# EAGLE design timer (EAGLE 9.3.0)
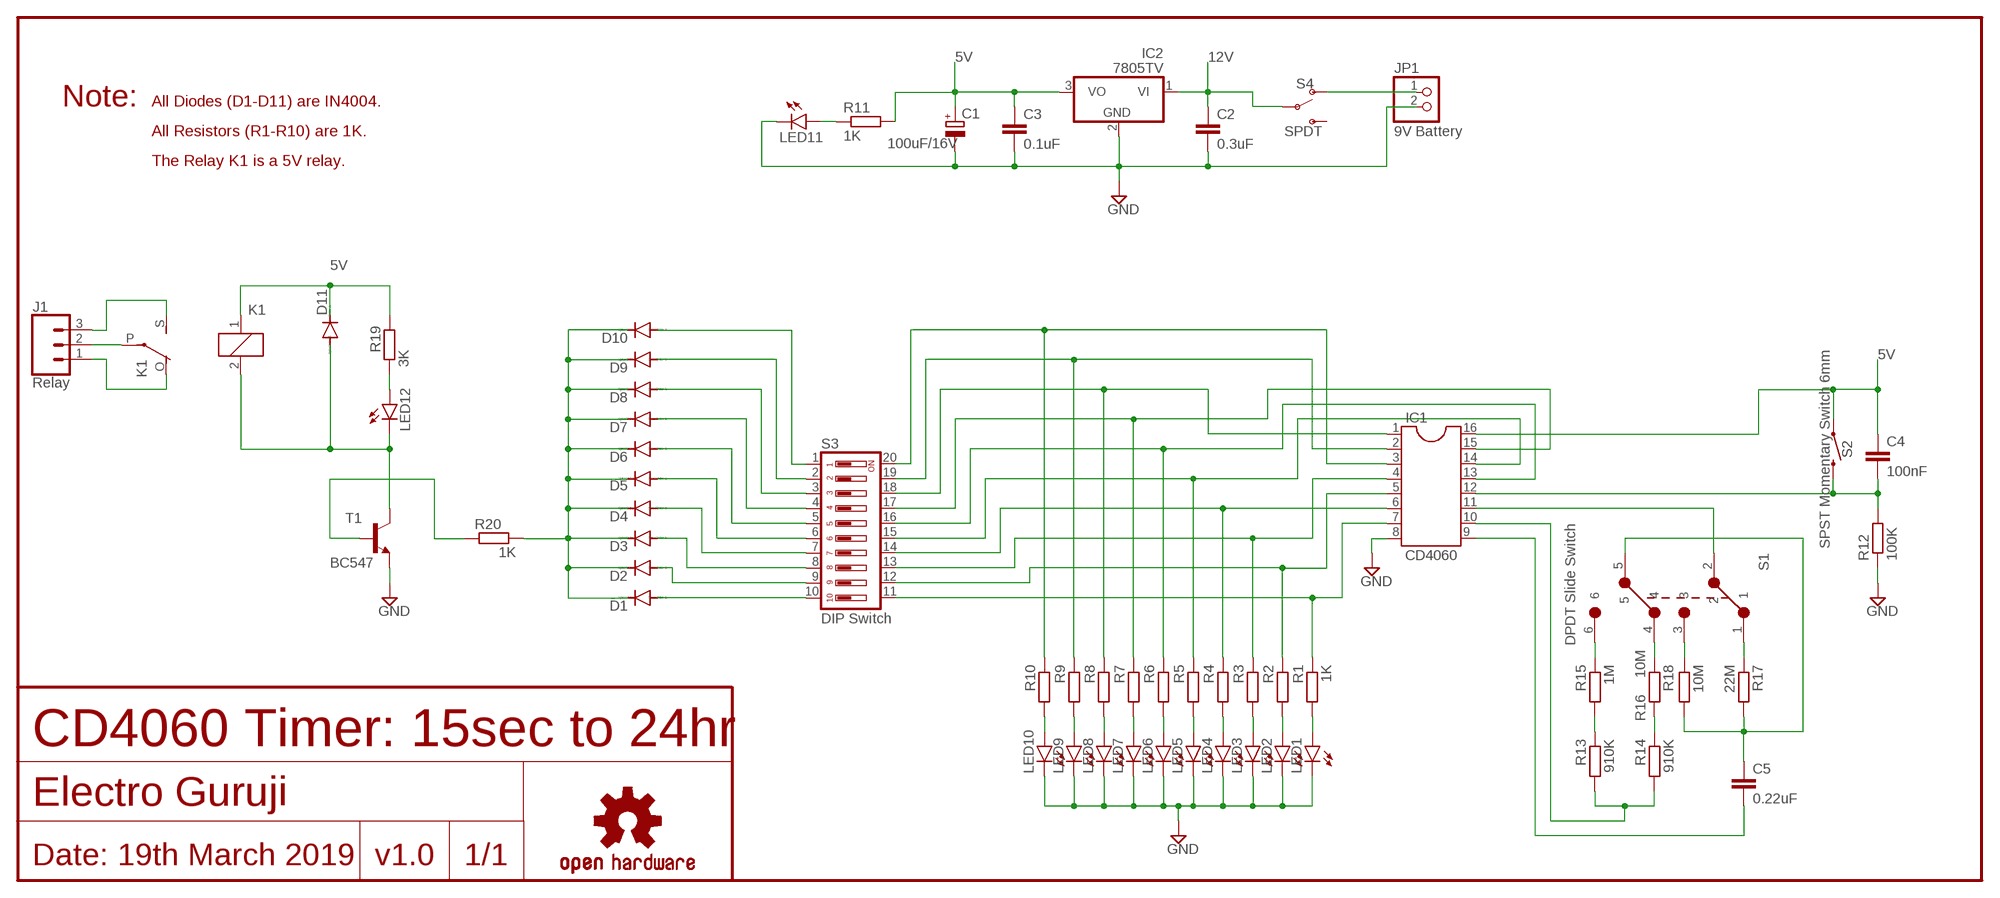
[diagram p0: schematic, sheet 1]

## Parts
C1  100uF/16V  CPOL-EUE2.5-6  [E2,5-6]
C2  0.3uF  C-EU025-050X050  [C025-050X050]
C3  0.1uF  C-EU025-050X050  [C025-050X050]
C4  100nF  C-EU025-050X050  [C025-050X050]
C5  0.22uF  C-EU102-043X133  [C102-043X133]
D1  1N4004  [DO41-10]
D2  1N4004  [DO41-10]
D3  1N4004  [DO41-10]
D4  1N4004  [DO41-10]
D5  1N4004  [DO41-10]
D6  1N4004  [DO41-10]
D7  1N4004  [DO41-10]
D8  1N4004  [DO41-10]
D9  1N4004  [DO41-10]
D10  1N4004  [DO41-10]
D11  1N4004  [DO41-10]
IC1  CD4060  DIL16S  [SOCKET-16]
IC2  7805TV  [TO220V]
J1  Relay  CONN_03-SCREW-5MM  [SCREWTERMINAL-5MM-3]
JP1  9V Battery  PINHD-1X2  [1X02]
K1  5V  ZF112  [ZF112]
LED1  LED5MM  [LED5MM]
LED2  LED5MM  [LED5MM]
LED3  LED5MM  [LED5MM]
LED4  LED5MM  [LED5MM]
LED5  LED5MM  [LED5MM]
LED6  LED5MM  [LED5MM]
LED7  LED5MM  [LED5MM]
LED8  LED5MM  [LED5MM]
LED9  LED5MM  [LED5MM]
LED10  LED5MM  [LED5MM]
LED11  LED5MM  [LED5MM]
LED12  LED5MM  [LED5MM]
LOGO1  OSHW-LOGOS-COPPER  [OSHW-LOGO-S_COPPER]
R1  1K  R-EU_0207/10  [0207/10]
R2  R-EU_0207/10  [0207/10]
R3  R-EU_0207/10  [0207/10]
R4  R-EU_0207/10  [0207/10]
R5  R-EU_0207/10  [0207/10]
R6  R-EU_0207/10  [0207/10]
R7  R-EU_0207/10  [0207/10]
R8  R-EU_0207/10  [0207/10]
R9  R-EU_0207/10  [0207/10]
R10  R-EU_0207/10  [0207/10]
R11  1K  R-EU_0207/10  [0207/10]
R12  100K  R-EU_0207/10  [0207/10]
R13  910K  R-EU_0207/10  [0207/10]
R14  910K  R-EU_0207/10  [0207/10]
R15  1M  R-EU_0207/10  [0207/10]
R16  10M  R-EU_0207/10  [0207/10]
R17  22M  R-EU_0207/10  [0207/10]
R18  10M  R-EU_0207/10  [0207/10]
R19  3K  R-EU_0207/10  [0207/10]
R20  1K  R-EU_0207/10  [0207/10]
S1  DPDT Slide Switch  DPDT_SEC  [DPDT_SEC]
S2  SPST Momentary Switch 6mm  MOMENTARY-SWITCH-SPST-PTH-6.0MM  [TACTILE_SWITCH_PTH_6.0MM]
S3  DIP Switch  DIP10YL  [DIP10YL]
S4  SPDT  SWITCH-SPDT-PTH-11.6X4.0MM  [SWITCH_SPDT_PTH_11.6X4.0MM]
T1  BC547  -NPN-TO92-EBC  [TO92-EBC]

## Nets
5V: C1.+ C3.1 C4.1 D11.C IC1.16 IC2.3(VO) K1.1 R11.2 R19.2 S2.1
12V: C2.1 IC2.1(VI) S4.2(P)
GND: C1.- C2.2 C3.2 IC1.8 IC2.2(GND) JP1.2 LED1.K(C) LED2.K(C) LED3.K(C) LED4.K(C) LED5.K(C) LED6.K(C) LED7.K(C) LED8.K(C) LED9.K(C) LED10.K(C) LED11.K(C) R12.1 T1.E
N$1: C4.2 IC1.12 R12.2 S2.3
N$2: LED11.A R11.1
N$3: IC1.10 R13.2 R14.2
N$4: IC1.7 R1.1 S3.11
N$5: R13.1 R15.2
N$6: R14.1 R16.2
N$7: C5.1 R17.2 R18.2 S1.5
N$8: R18.1 S1.3
N$9: R17.1 S1.1
N$10: R16.1 S1.4
N$11: R15.1 S1.6
N$12: IC1.11 S1.2
N$13: C5.2 IC1.9
N$14: D1.A S3.10
N$15: IC1.5 R2.1 S3.12
N$16: IC1.4 R3.1 S3.13
N$17: IC1.6 R4.1 S3.14
N$18: IC1.14 R5.1 S3.15
N$19: IC1.13 R6.1 S3.16
N$20: IC1.15 R7.1 S3.17
N$21: IC1.1 R8.1 S3.18
N$22: IC1.2 R9.1 S3.19
N$23: IC1.3 R10.1 S3.20
N$24: D2.A S3.9
N$25: D3.A S3.8
N$26: D4.A S3.7
N$27: D5.A S3.6
N$28: D6.A S3.5
N$29: D7.A S3.4
N$30: D8.A S3.3
N$31: D9.A S3.2
N$32: D10.A S3.1
N$33: LED10.A R10.2
N$34: LED9.A R9.2
N$35: LED8.A R8.2
N$36: LED7.A R7.2
N$37: LED6.A R6.2
N$38: LED5.A R5.2
N$39: LED4.A R4.2
N$40: LED3.A R3.2
N$41: LED2.A R2.2
N$42: LED1.A R1.2
N$44: R20.2 T1.B
N$45: D11.A K1.2 LED12.K(C) T1.C
N$46: LED12.A R19.1
N$48: J1.2 K1.P(2:P)
N$49: J1.3 K1.S(2:S)
N$50: J1.1 K1.O(2:O)
N$51: JP1.1 S4.1(O)
N$52: D1.C D2.C D3.C D4.C D5.C D6.C D7.C D8.C D9.C D10.C R20.1
Unconnected: S4.3(S)

## Notes on the sheet
- Note: | All Diodes (D1-D11) are IN4004.
- All Resistors (R1-R10) are 1K.
- The Relay K1 is a 5V relay.
- CD4060 Timer: 15sec to 24hr
- Electro Guruji
- Date: 19th March 2019 | v1.0 | 1/1

## Library data of the parts
C1 = resistor:CPOL-EU: POLARIZED CAPACITOR, European symbol
C2-C5 = resistor:C-EU: CAPACITOR, European symbol
D1-D11 = diode:1N4004: DIODE general purpose rectifier, 1 A
IC1 = ic-package:DIL16: Dual In Line / Socket
IC2 = linear:78*: Positive VOLTAGE REGULATOR Source: http://cache.national.com/ds/LM/LM78L05.pdf http://www.fairchildsemi.com/ds/LM/LM7805.pdf
J1 = SparkFun-Connectors:CONN_03: Multi connection point. Often used as Generic Header-pin footprint for 0.1 inch spaced/style header connections On any of the 0.1 inch spaced packages, you can populate with these: Break Away Headers - Straight <https://www.sparkfun.com/products/116> (PRT-00116) Break Away Male Headers - Right Angle <https://www.sparkfun.com/products/553> (PRT-00553) Female Headers <https://www.sparkfun.com/products/115> (PRT-00115) Break Away Headers - Machine Pin <https://www.sparkfun.com/products/117> (PRT-00117) Break Away Female Headers - Swiss Machine Pin <https://www.sparkfun.com/products/743> (PRT-00743) Stackable Header - 3 Pin (Female, 0.1") <https://www.sparkfun.com/products/13875> (PRT-13875) For SCREWTERMINALS and SPRING TERMINALS visit here: Screw Terimnals on SparkFun.com <https://www.sparkfun.com/search/results?term=Screw+Terminals> (5mm/3.5mm/2.54mm spacing) This device is also useful as a general connection point to wire up your design to another part of your project. Our various solder wires solder well into these plated through hole pads. Hook-Up Wire - Assortment (Stranded, 22 AWG) <https://www.sparkfun.com/products/11375> (PRT-11375) Hook-Up Wire - Assortment (Solid Core, 22 AWG) <https://www.sparkfun.com/products/11367> (PRT-11367) View the entire wire category on our website here <https://www.sparkfun.com/categories/141> Special notes: Molex polarized connector foot print use with SKU : PRT-08232 with associated crimp pins and housings.; PROD_ID: CONN-10134; SF_SKU: PRT-08433
JP1 = pinhead:PINHD-1X2: PIN HEADER
K1 = relay:ZF112: RELAY 1 x switch; OC_FARNELL: unknown; OC_NEWARK: unknown
LED1-LED12 = led:LED: LED OSRAM: - CHIPLED LG R971, LG N971, LY N971, LG Q971, LY Q971, LO R971, LY R971 LH N974, LH R974 LS Q976, LO Q976, LY Q976 LO Q996 - Hyper CHIPLED LW Q18S LB Q993, LB Q99A, LB R99A - SideLED LS A670, LO A670, LY A670, LG A670, LP A670 LB A673, LV A673, LT A673, LW A673 LH A674 LY A675 LS A676, LA A676, LO A676, LY A676, LW A676 LS A679, LY A679, LG A679 - Hyper Micro SIDELED® LS Y876, LA Y876, LO Y876, LY Y876 LT Y87S - SmartLED LW L88C, LW L88S LB L89C, LB L89S, LG L890 LS L89K, LO L89K, LY L89K LS L896, LA L896, LO L896, LY L896 - TOPLED LS T670, LO T670, LY T670, LG T670, LP T670 LSG T670, LSP T670, LSY T670, LOP T670, LYG T670 LG T671, LOG T671, LSG T671 LB T673, LV T673, LT T673, LW T673 LH T674 LS T676, LA T676, LO T676, LY T676, LB T676, LH T676, LSB T676, LW T676 LB T67C, LV T67C, LT T67C, LS T67K, LO T67K, LY T67K, LW E67C LS E67B, LA E67B, LO E67B, LY E67B, LB E67C, LV E67C, LT E67C LW T67C LS T679, LY T679, LG T679 LS T770, LO T770, LY T770, LG T770, LP T770 LB T773, LV T773, LT T773, LW T773 LH T774 LS E675, LA E675, LY E675, LS T675 LS T776, LA T776, LO T776, LY T776, LB T776 LHGB T686 LT T68C, LB T68C - Hyper Mini TOPLED® LB M676 - Mini TOPLED Santana® LG M470 LS M47K, LO M47K, LY M47K Source: http://www.osram.convergy.de LUXEON: - LUMILED® LXK2-PW12-R00, LXK2-PW12-S00, LXK2-PW14-U00, LXK2-PW14-V00 LXK2-PM12-R00, LXK2-PM12-S00, LXK2-PM14-U00 LXK2-PE12-Q00, LXK2-PE12-R00, LXK2-PE12-S00, LXK2-PE14-T00, LXK2-PE14-U00 LXK2-PB12-K00, LXK2-PB12-L00, LXK2-PB12-M00, LXK2-PB14-N00, LXK2-PB14-P00, LXK2-PB14-Q00 LXK2-PR12-L00, LXK2-PR12-M00, LXK2-PR14-Q00, LXK2-PR14-R00 LXK2-PD12-Q00, LXK2-PD12-R00, LXK2-PD12-S00 LXK2-PH12-R00, LXK2-PH12-S00 LXK2-PL12-P00, LXK2-PL12-Q00, LXK2-PL12-R00 Source: www.luxeon.com KINGBRIGHT: KA-3528ASYC Source: www.kingbright.com
LOGO1 = SparkFun-Aesthetics:OSHW-LOGO: Open-Source Hardware (OSHW) Logo This logo indicates the piece of hardware it is found on incorporates a OSHW license and/or adheres to the definition of open source hardware found here: http://freedomdefined.org/OSHW
R1-R20 = resistor:R-EU_: RESISTOR, European symbol
S1 = mylibrary:DPDT_SEC: SEC - DPDT Slide Switch A DPDT Slide Switch with 2 mounting holes and "SEC" inscripted on it
S2 = SparkFun-Switches:MOMENTARY-SWITCH-SPST: Momentary Switch (Pushbutton) - SPST Normally-open (NO) SPST momentary switches (buttons, pushbuttons). Variants PTH-12MM - 12mm square, through-hole Momentary Pushbutton Switch - 12mm Square <https://www.sparkfun.com/products/9190> (COM-09190) PTH-6.0MM, PTH-6.0MM-KIT - 6.0mm square, through-hole Mini Pushbutton Switch <https://www.sparkfun.com/products/97> (COM-00097) KIT package intended for soldering kit's - only one side of pads' copper is exposed. PTH-RIGHT-ANGLE-KIT - Right-angle, through-hole Right Angle Tactile Button <https://www.sparkfun.com/products/10791> - Used on SparkFun BigTime Watch Kit <https://www.sparkfun.com/products/11734> SMD-12MM - 12mm square, surface-mount Tactile Button - SMD (12mm) <https://www.sparkfun.com/products/12993> (COM-12993) Used on SparkFun PicoBoard <https://www.sparkfun.com/products/11888> SMD-4.5MM - 4.5mm Square Trackball Switch Used on SparkFun Blackberry Trackballer Breakout <https://www.sparkfun.com/products/13169> SMD-4.6MMX2.8MM - 4.60mm x 2.80mm, surface mount Used on SparkFun SAMD21 Mini Breakout <https://www.sparkfun.com/products/13664> SMD-5.2MM, SMD-5.2-REDUNDANT - 5.2mm square, surface-mount Mini Pushbutton Switch - SMD <https://www.sparkfun.com/products/8720> (COM-08720) Used on Arduino Pro Mini <https://www.sparkfun.com/products/11114> REDUNDANT package connects both switch circuits together SMD-6.0X3.5MM - 6.0 x 3.5mm, surface mount Momentary Reset Switch SMD <https://www.sparkfun.com/products/8229> (COM-08229) SMD-6.2MM-TALL - 6.2mm square, surface mount Tactile Button - SMD (6mm) <https://www.sparkfun.com/products/12992> Used on SparkFun Digital Sandbox <https://www.sparkfun.com/products/12651> SMD-RIGHT-ANGLE - Right-angle, surface mount Used on SparkFun Block for Intel® Edison - Arduino <https://www.sparkfun.com/products/13036>; PROD_ID: SWCH-08441; SF_SKU: COM-00097
S3 = switch-dil:DIP10YL: DIL/CODE SWITCH; OC_FARNELL: unknown; OC_NEWARK: unknown
S4 = SparkFun-Switches:SWITCH-SPDT: Single Pole, Double Throw (SPDT) Switch Single-pole, double-throw (SPDT) switch. Variant Overview SMD-AYZ0202 Surface Mount DPDT Switch <https://www.sparkfun.com/products/597> (COM-00597) Used on e.g. LilyPad Arduino USB - ATmega32U4 Board <https://www.sparkfun.com/products/12049> PTH-11.6X4.0MM SPDT Mini Power Switch <https://www.sparkfun.com/products/102> (COM-00102) Used on e.g. SparkFun Simon Says - Through-Hole Soldering Kit <https://www.sparkfun.com/products/10547> (KIT-10547) PTH-11.6X4.0MM-KIT KIT version of SPDT Mini Power Switch - Simplifies soldering by removing tStop of switch pins - only one side can be soldered. PTH-11.6X4.0MM-LOCK LOCK version of SPDT Mini Power Switch - Offset pins hold switch in place for easier soldering. SMD-RIGHT-ANGLE Surface Mount Right Angle Switch <https://www.sparkfun.com/products/10860> (COM-10860) Used on e.g. SparkFun ESP8266 Thing <https://www.sparkfun.com/products/13231>; PROD_ID: SWCH-08261; SF_SKU: COM-00102
T1 = transistor:*-NPN-: NPN Transistror BF959 corrected 2008.03.06

## Board
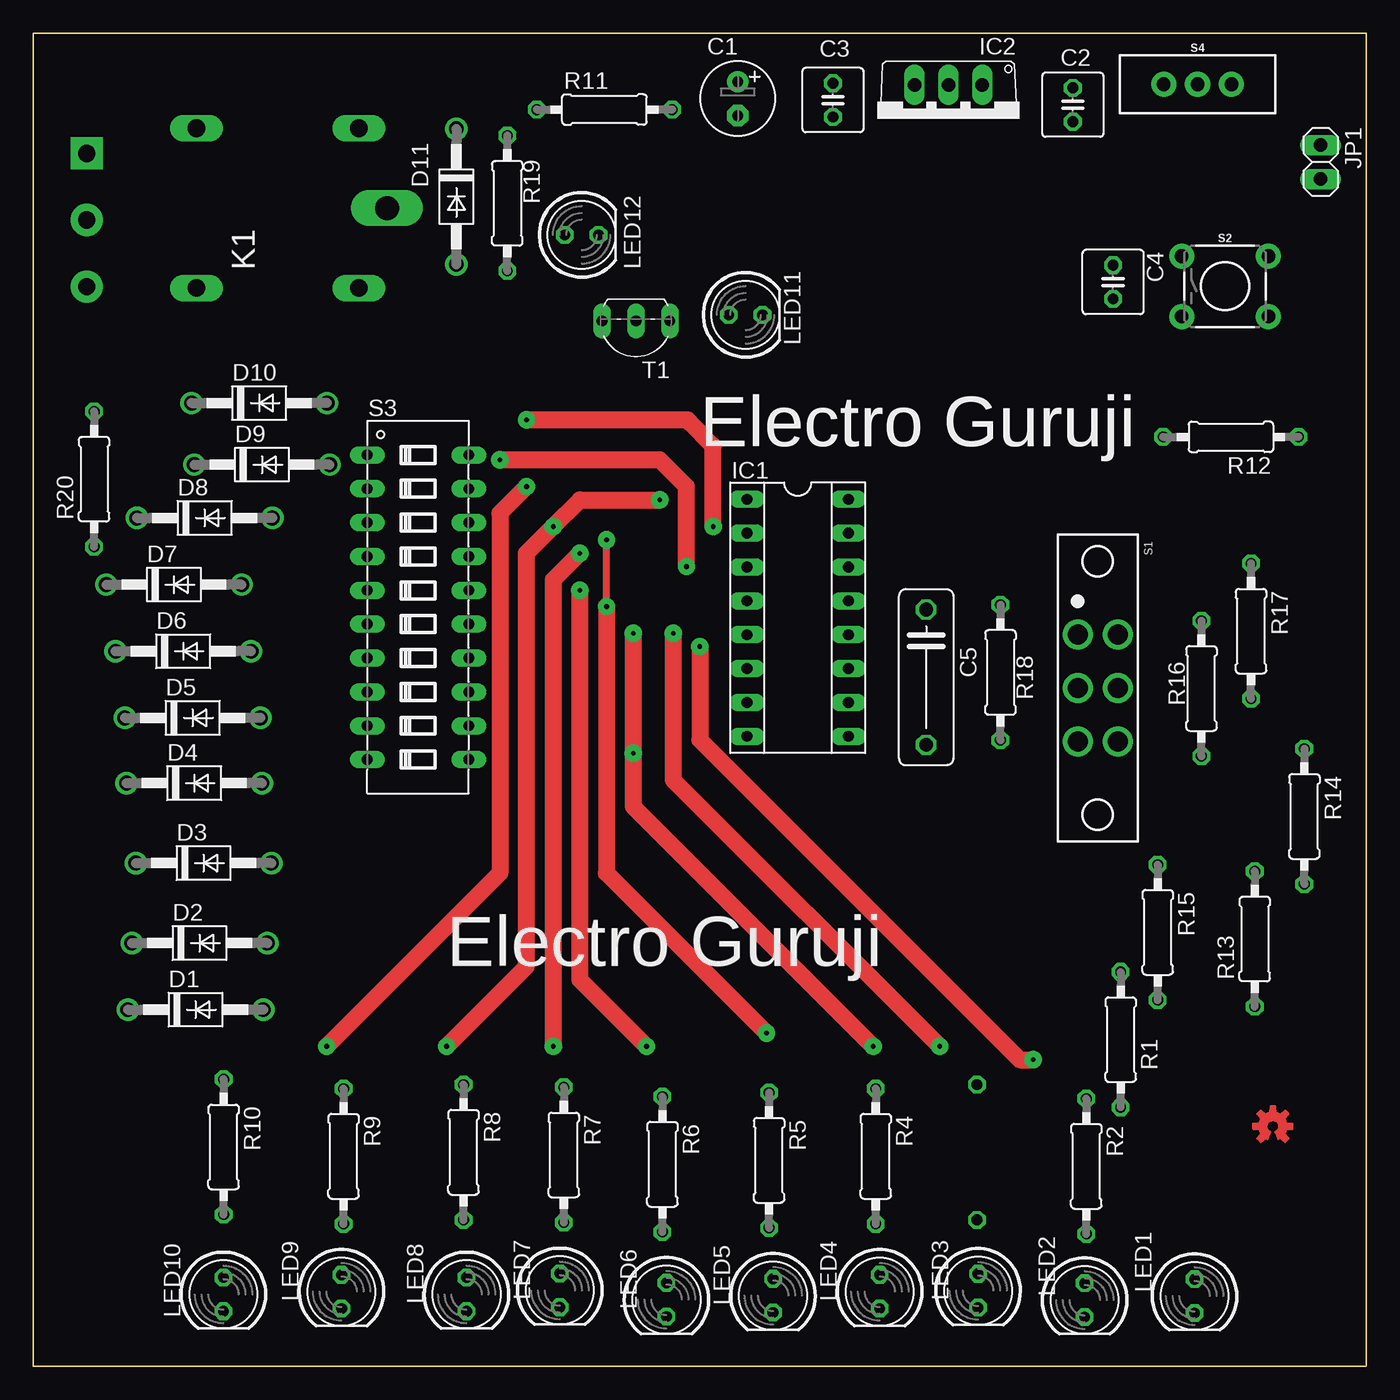
[diagram p1: board, top side]
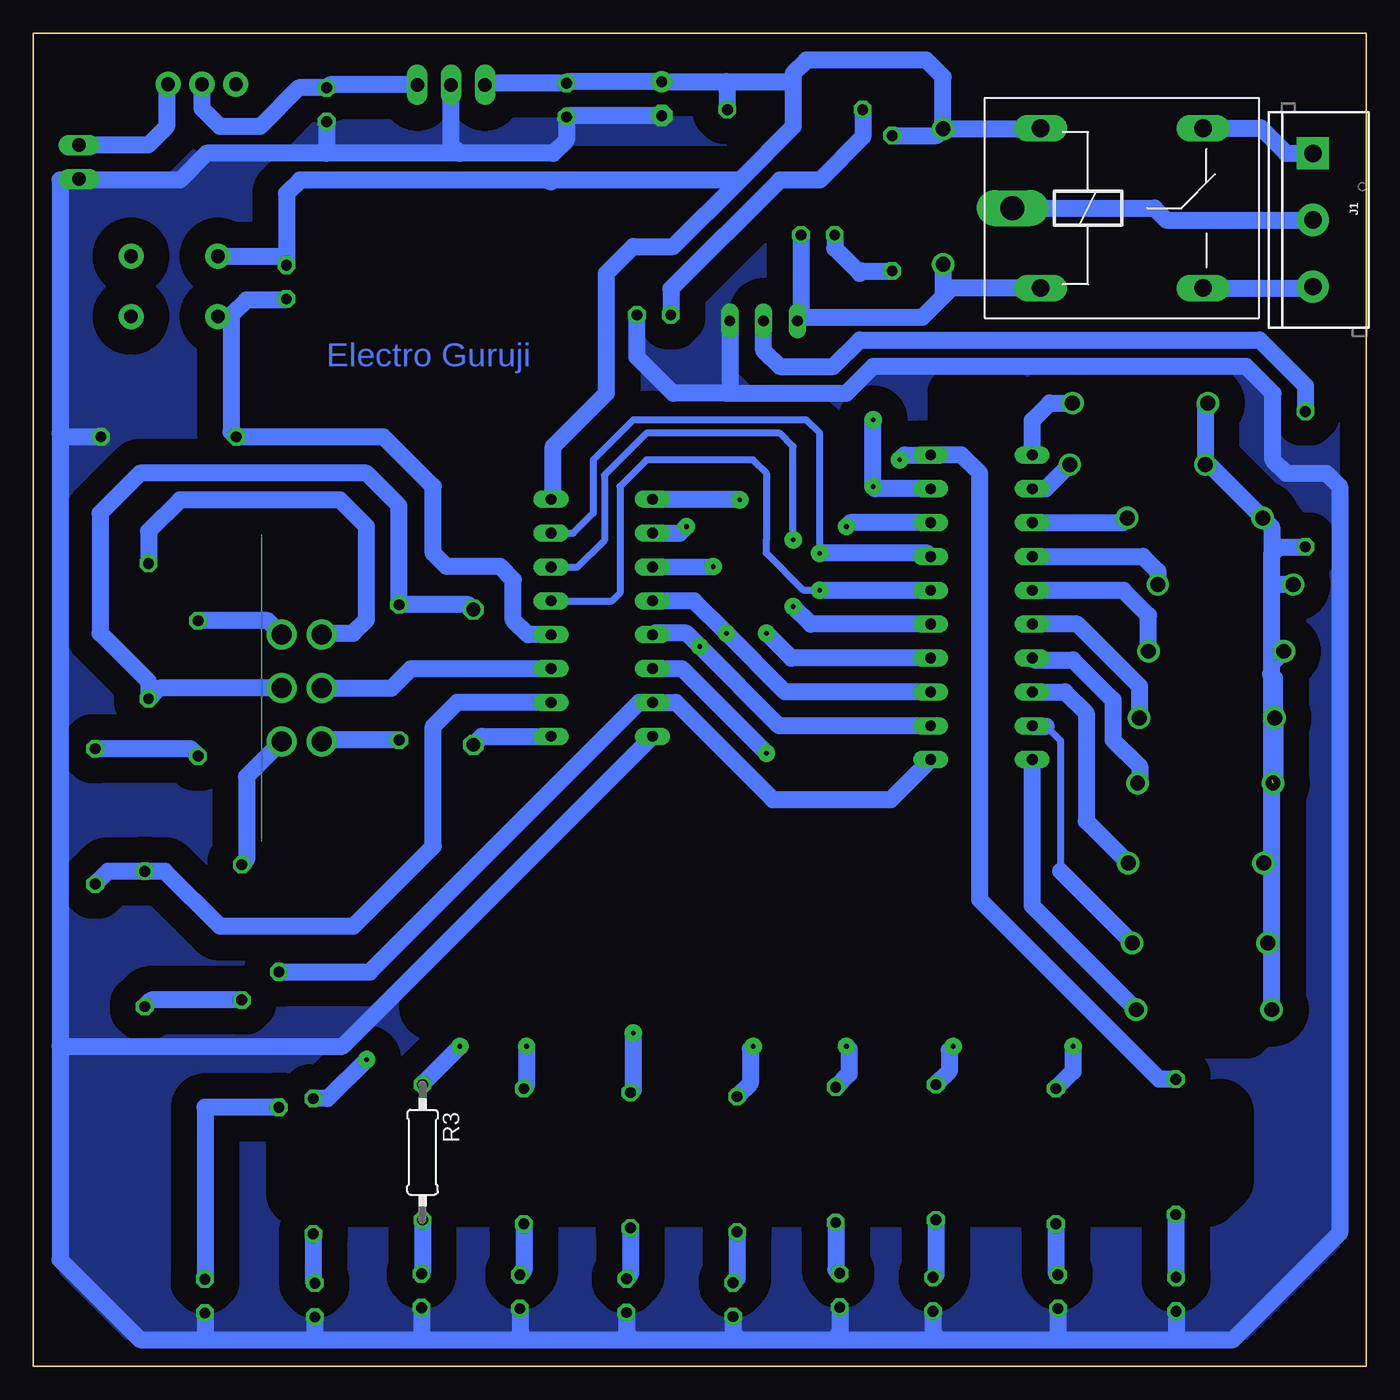
[diagram p2: board, bottom side, seen from below]

Size 100 x 100 mm. Coordinates in mm from the lower left corner, seen from the top.
Outline: 0,100 0,0 100,0 100,100 0,100
Copper layers (1*16): Top 0.035mm / dielectric 1.5mm / Bottom 0.035mm
Design rules "default": minimum track width 6mil, minimum drill 0.35mm, track to track 6mil, track to pad 6mil, pad to pad 6mil, via to via 6mil, smd to smd 6mil, copper to edge 40mil, drill to drill 6mil, minimum pad ring 10mil, minimum via ring 8mil, stop-mask expansion 4mil, vias tented up to drill 0mil, thermal gap 10mil
bRestrict: area 15,66 to 19,74; area 11,62 to 15,65; area 9,25 to 15,60; area 27,42 to 31,73; area 24,26 to 70,45; area 11,13 to 80,19

### Footprints (pad centres in the part's own frame; a part is rotated, then mirrored left to right if it is on the bottom)
E2,5-6 = drill 0.813 pad 1.6: + -1.27,0 | drill 0.813 pad 1.6 octagon: - 1.27,0
C025-050X050 = drill 0.813 octagon: 1 -1.27,0; 2 1.27,0
C102-043X133 = drill 1.016 octagon: 1 -5.08,0; 2 5.08,0
DO41-10 = drill 1.118: A 5.08,0; C -5.08,0
SOCKET-16 = drill 0.813 long: 1 -8.89,-3.81; 2 -6.35,-3.81; 3 -3.81,-3.81; 4 -1.27,-3.81; 5 1.27,-3.81; 6 3.81,-3.81; 7 6.35,-3.81; 8 8.89,-3.81; 9 8.89,3.81; 10 6.35,3.81; 11 3.81,3.81; 12 1.27,3.81; 13 -1.27,3.81; 14 -3.81,3.81; 15 -6.35,3.81; 16 -8.89,3.81
TO220V = drill 1.016 long: 1 -2.54,-2.54; 2 0,-2.54; 3 2.54,-2.54
SCREWTERMINAL-5MM-3 = drill 1.3 pad 2.413 square: 1 0,0 | drill 1.3 pad 2.413: 2 5,0; 3 10,0
1X02 = drill 1.016 long: 1 -1.27,0; 2 1.27,0
ZF112 = drill 1.321 long: 1 -6.096,5.994; 2 -6.096,-5.994; O 6.096,5.994; S 6.096,-5.994 | drill 1.803 long: P -8.204,0
LED5MM = drill 0.813 octagon: A -1.27,0; K 1.27,0
0207/10 = drill 0.813 octagon: 1 -5.08,0; 2 5.08,0
DPDT_SEC = drill 1.5 pad 2.184: 1 -4,-1.5; 2 0,-1.5; 3 4,-1.5; 4 -4,1.5; 5 0,1.5; 6 4,1.5
TACTILE_SWITCH_PTH_6.0MM = drill 1.016 pad 1.88: 1 -3.251,2.261; 2 3.251,2.261; 3 -3.251,-2.261; 4 3.251,-2.261
DIP10YL = drill 0.813 long: 1 -11.43,-3.81; 2 -8.89,-3.81; 3 -6.35,-3.81; 4 -3.81,-3.81; 5 -1.27,-3.81; 6 1.27,-3.81; 7 3.81,-3.81; 8 6.35,-3.81; 9 8.89,-3.81; 10 11.43,-3.81; 11 11.43,3.81; 12 8.89,3.81; 13 6.35,3.81; 14 3.81,3.81; 15 1.27,3.81; 16 -1.27,3.81; 17 -3.81,3.81; 18 -6.35,3.81; 19 -8.89,3.81; 20 -11.43,3.81
SWITCH_SPDT_PTH_11.6X4.0MM = drill 1.016 pad 1.88: 1 0,2.54; 2 0,0; 3 0,-2.54
TO92-EBC = drill 0.813 long: B 0,-1.27; C 2.54,-1.27; E -2.54,-1.27

### Placement (x,y rotation side)
C1  52.85,95.1 270 top
C2  77.99,94.64 270 top
C3  59.99,94.99 270 top
C4  81.01,81.34 270 top
C5  66.99,51.69 270 top
D1  12.17,26.75 0 top
D2  12.47,31.75 0 top
D3  12.77,37.75 0 top
D4  12.07,43.75 0 top
D5  11.95,48.64 0 top
D6  11.25,53.64 0 top
D7  10.55,58.64 0 top
D8  12.85,63.64 0 top
D9  17.15,67.64 0 top
D10  16.95,72.26 0 top
D11  31.74,87.75 270 top
IC1  57.35,56.15 270 top
IC2  68.66,93.6 180 top
J1  4,91 270 bottom
JP1  96.58,90.34 270 top
K1  18.33,86.89 0 bottom
LED1  87.12,5.26 270 top
LED2  78.88,4.96 270 top
LED3  70.88,5.66 270 top
LED4  63.5,5.59 270 top
LED5  55.5,5.29 270 top
LED6  47.5,4.99 270 top
LED7  39.5,5.69 270 top
LED8  32.5,5.39 270 top
LED9  23.12,5.59 270 top
LED10  14.26,5.39 270 top
LED11  53.44,78.88 0 top
LED12  41.14,84.88 0 top
LOGO1  93,18 0 top
R1  81.58,24.5 270 top
R2  79,15 270 top
R3  70.8,16.05 270 bottom
R4  63.2,15.75 270 top
R5  55.2,15.45 270 top
R6  47.2,15.15 270 top
R7  39.8,15.85 270 top
R8  32.28,16.05 270 top
R9  23.28,15.75 270 top
R10  14.28,16.45 270 top
R11  42.85,94.28 0 top
R12  89.85,69.72 180 top
R13  91.64,32.05 90 top
R14  95.36,41.25 270 top
R15  84.36,32.55 270 top
R16  87.64,50.85 270 top
R17  91.36,55.15 270 top
R18  72.56,52.05 90 top
R19  35.56,87.25 90 top
R20  4.56,66.55 90 top
S1  79.86,50.88 270 top
S2  89.41,81.02 0 top
S3  28.86,56.94 270 top
S4  87.35,96.18 270 top
T1  45.21,77.15 180 top

### Tracks (layer width: path | path; a pad name or v marks a point on that pad's centre or on a via)
5V
  Bottom 1.27: 48,96.37 C1.+ 59.88,96.37 C3.1 66,96.26 IC2.3 | 48,96.37 43.37,96.37 43,96 | 47,89 43,93 43,96 | 47,89 61,89 | 61.16,88.84 61,89 | R11.2 47.93,96.3 48,96.37 | 81.01,83 81.01,87.99 80,89 61,89 | 81.01,83 C4.1 | IC1.16 61,65.2 61,69 57,73 57,82 55,84 52,84 47,89 | S2.1 81.29,83.28 81.01,83 | R19.2 32.24,92.33 D11.C | D11.C 24.48,92.83 K1.1 | D11.C 31.74,96.74 33,98 42,98 43,97 43,96
12V
  Bottom 1.27: IC2.1 77.76,96.14 C2.1 80.09,95.91 83,93 86,93 87.35,94.35 S4.2
GND
  Bottom 1.27: IC1.8 76.8,24 98,24 | 98,70 98,89 96.65,89 JP1.2 96.51,89 89,89 87,91 78,91 | 98,70 98,24 | 98,24 98,8 92,2 87,2 | 87,2 79,2 | 79,2 71,2 | 71,2 63,2 | 63,2 55,2 | 55,2 47,2 | 47,2 40,2 | 40,2 32,2 | 32,2 23,2 | 23,2 14,2 | 14,2 10,2 2,10 2,66 3,67 6,67 7,68 7,73 9,75 37,75 39,73 48,73 | LED9.K 23.12,2.12 23,2 | LED8.K 32.5,2.5 32,2 | LED7.K 39.5,2.5 40,2 | LED6.K 47.5,2.5 47,2 | LED5.K 55.5,2.5 55,2 | LED4.K 63.5,2.5 63,2 | LED3.K 70.88,2.12 71,2 | LED2.K 78.88,2.12 79,2 | LED1.K 87.12,2.12 87,2 | LED10.K 14.26,2.26 14,2 | T1.E 47.75,73.25 48,73 | 48,73 52,73 54.71,75.71 LED11.K | C1.- 59.88,93.83 C3.2 60,92 61,91 68,91 | 68,91 68.66,91.66 IC2.2 | 68,91 78,91 | C2.2 77.99,91.01 78,91 | R12.1 97.72,69.72 98,70
  pour Bottom (isolate 1.93, no thermals): 0,100 100,100 100,9 91,0 11,0 0,11
N$1
  Bottom 1.27: IC1.12 62.88,54.88 64,56 64,59 65,60 69,60 70,61 70,66 73.72,69.72 80,69.72 | 80,69.72 R12.2 85.16,70.11 85.16,78.84 | 80.01,69.73 80,69.72 | 85.16,78.84 84,80 81.08,80 C4.2 | S2.3 85.24,78.76 85.16,78.84
N$2
  Bottom 1.27: R11.1 37.77,92.23 41,89 44,89 52.17,80.83 LED11.A
N$3
  Bottom 1.27: IC1.10 68.2,49.8 70,48 70,39 76,33 86,33 90.13,37.13 R13.2 94.4,37.13 R14.2
N$4
  Bottom 1.27: R1.1 74.76,29.58 54.54,49.8 IC1.7 51.8,49.8 44.51,42.51 35.67,42.51 S3.11
N$5
  Bottom 1.27: R15.2 91.14,27.47 R13.1
N$6
  Bottom 1.27: R14.1 88.2,46.33 R16.2
N$7
  Bottom 1.27: S1.5 90.55,50.88 R17.2 91.36,51.36 95,55 95,64 92,67 75,67 72.56,64.56 R18.2 67.35,57.13 C5.1
N$8
  Bottom 1.27: R18.1 78.27,46.97 S1.3
N$9
  Bottom 1.27: S1.1 78.24,55 76,55 75,56 75,63 77,65 89,65 91.36,62.64 R17.1
N$10
  Bottom 1.27: S1.4 82.41,55.93 R16.1
N$11
  Bottom 1.27: S1.6 84,44.24 84,37.99 R15.1
N$12
  Bottom 1.27: S1.2 73.12,50.88 71.66,52.34 IC1.11
N$13
  Bottom 1.27: C5.2 66.34,47.26 IC1.9
N$14
  Bottom 1.27: D1.A 25.05,34.55 S3.10
N$15  (via drill 0.35 pad 1.3)
  Top 1.27: v50,54 50,47 74,23 v75,23
  Bottom 1.27: S3.12 44.05,48.05 v50,54 51,55 53.42,55 IC1.5 | v75,23 77.92,20.08 R2.1
N$16  (via drill 0.35 pad 1.3)
  Top 1.27: v48,55 48,44 v68,24
  Bottom 1.27: S3.13 43.59,50.59 v48,55 50.42,57.42 IC1.4 | v68,24 70.8,21.2 R3.1
N$17  (via drill 0.35 pad 1.3)
  Top 1.27: v45,55 v45,46 45,42 v63,24
  Bottom 1.27: IC1.6 51.34,52.34 v45,46 | S3.14 43.13,53.13 v45,55 | v63,24 63,21.03 R4.1
N$18  (via drill 0.35 pad 1.3)
  Top 0.508: v43,57 v43,62
  Top 1.27: v43,57 43,37 v55,25
  Bottom 0.508: IC1.14 59.16,59.96 57.16,61.96 57.16,66.84 54,70 44,70 43,69 v43,62
  Bottom 1.27: S3.15 41.67,55.67 v43,57 | v55,25 55,20.73 R5.1
N$19  (via drill 0.35 pad 1.3)
  Top 1.27: v46,24 41,29 v41,58.21
  Bottom 0.508: IC1.13 56.58,57.42 56,58 56,66 54,68 46,68 45,67 45,62 45,61 42.21,58.21 v41,58.21 41.21,58.21 | 32.88,58 S3.16
  Bottom 1.27: S3.16 v41,58.21 | v46,24 46.2,23.8 46.2,21.23 R6.1
N$20  (via drill 0.35 pad 1.3)
  Top 1.27: v41,61 39,59 v39,24
  Bottom 0.508: IC1.15 59.5,62.5 58,64 58,68 55,71 42,71 41,70 v41,61 | S3.17 32.92,61
  Bottom 1.27: 32.92,61 v41,61 | v39,24 38.8,23.8 38.8,21.93 R7.1
N$21  (via drill 0.35 pad 1.3)
  Top 1.27: v47,65 41,65 v39,63 37,61 37,30 v31,24
  Bottom 0.508: 47.04,65.04 v47,65
  Bottom 1.27: IC1.1 47.04,65.04 | S3.18 38.71,63.29 v39,63 | R8.1 31.28,22.13 31.28,23.72 v31,24
N$22  (via drill 0.35 pad 1.3)
  Top 1.27: v51,63 51,69.03 49.22,70.82 arc90 49.03,71 v37,71 | v37,66 35,64 35,37 v22,24
  Bottom 1.27: IC1.2 51.5,62.5 v51,63 | S3.19 36.83,65.83 v37,66 v37,71 | v22,24 22,22.11 R9.1
N$23  (via drill 0.35 pad 1.3)
  Top 1.27: v49,60 49,66 47,68 v35,68
  Bottom 1.27: IC1.3 v49,60 | v35,68 34.63,68.37 S3.20 30.37,68.37 29,67 29,35 15.53,21.53 R10.1
N$24
  Bottom 0.508: 24,48 22.94,46.94 22.94,37.14
  Bottom 1.27: S3.9 25,48 24,48 | 22.94,37.14 D2.A
N$25
  Bottom 1.27: S3.8 22.59,50.59 21,49 21,40.9 D3.A
N$26
  Bottom 1.27: S3.7 24.92,53 22,53 19,50 19,47 17,45 17,43.9 D4.A
N$27
  Bottom 1.27: D5.A 17,48.67 17,51 21.67,55.67 S3.6
N$28
  Bottom 1.27: D6.A 16.33,56.33 18.21,58.21 S3.5
N$29
  Bottom 1.27: D7.A 15.63,59.63 16.75,60.75 S3.4
N$30
  Bottom 1.27: S3.3 18.28,63.29 D8.A
N$31
  Bottom 1.27: S3.2 24.04,65.83 D9.A
N$32
  Bottom 1.27: S3.1 25.05,70.95 23.74,72.26 D10.A
N$33
  Bottom 1.27: R10.2 14.28,6.68 LED10.A
N$34
  Bottom 1.27: R9.2 23.28,7.02 LED9.A
N$35
  Bottom 1.27: R8.2 32.28,6.88 LED8.A
N$36
  Bottom 1.27: R7.2 39.8,7.26 LED7.A
N$37
  Bottom 1.27: R6.2 47.2,6.56 LED6.A
N$38
  Bottom 1.27: R5.2 55.2,6.86 LED5.A
N$39
  Bottom 1.27: R4.2 63.2,7.16 LED4.A
N$40
  Bottom 1.27: R3.2 70.8,7.01 LED3.A
N$41
  Bottom 1.27: R2.2 79,6.35 LED2.A
N$42
  Bottom 1.27: R1.2 87.12,19.42 LED1.A
N$44
  Bottom 1.27: R20.2 4.56,73.56 8,77 38,77 40,75 44,75 45.21,76.21 T1.B
N$45
  Bottom 1.27: K1.2 31.1,80.9 31.74,80.26 | D11.A 31.74,80.26 | LED12.K 42.41,78.68 | 42.41,78.68 T1.C | 31.74,80.26 33.32,78.68 42.41,78.68
N$46
  Bottom 1.27: LED12.A 39.87,83.87 38,82 37.83,82.17 R19.1
N$48
  Bottom 1.27: K1.P 15.89,86.89 15,86 J1.2
N$49
  Bottom 1.27: 12.13,81 K1.S 4.1,80.9 J1.3
N$50
  Bottom 1.27: 12.12,93 K1.O 7.88,92.88 6,91 J1.1
N$51
  Bottom 1.27: S4.1 90,96.07 90,93 91.39,91.61 JP1.1
N$52  (1 unrouted)
  Bottom 1.27: D1.C 7.09,32 | 7.09,32 7.09,37.15 | 7.09,37.15 7.09,44 | 7.09,44 7.09,52.72 D6.C 7.09,53.64 | 7.09,53.64 7.09,52 7.17,51.92 6.87,51.62 D5.C 6.87,44.22 7.09,44 | 7.09,53.64 7.09,58.64 | 7.09,58.64 7.09,60.91 | R20.1 6.53,61.47 7.09,60.91 | D10.C 12.07,72.06 D9.C 11.77,67.64 D8.C 7.09,62.96 7.09,60.91 | D7.C 7.09,58.64 | D2.C 7.14,32 7.09,32 | D3.C 7.09,37.15

### Text on the board
Bottom: Electro Guruji
tPlace: Electro Guruji | Electro Guruji | Electro Guruji